# Altium schematic sheet GPIO.SchDoc
size A3
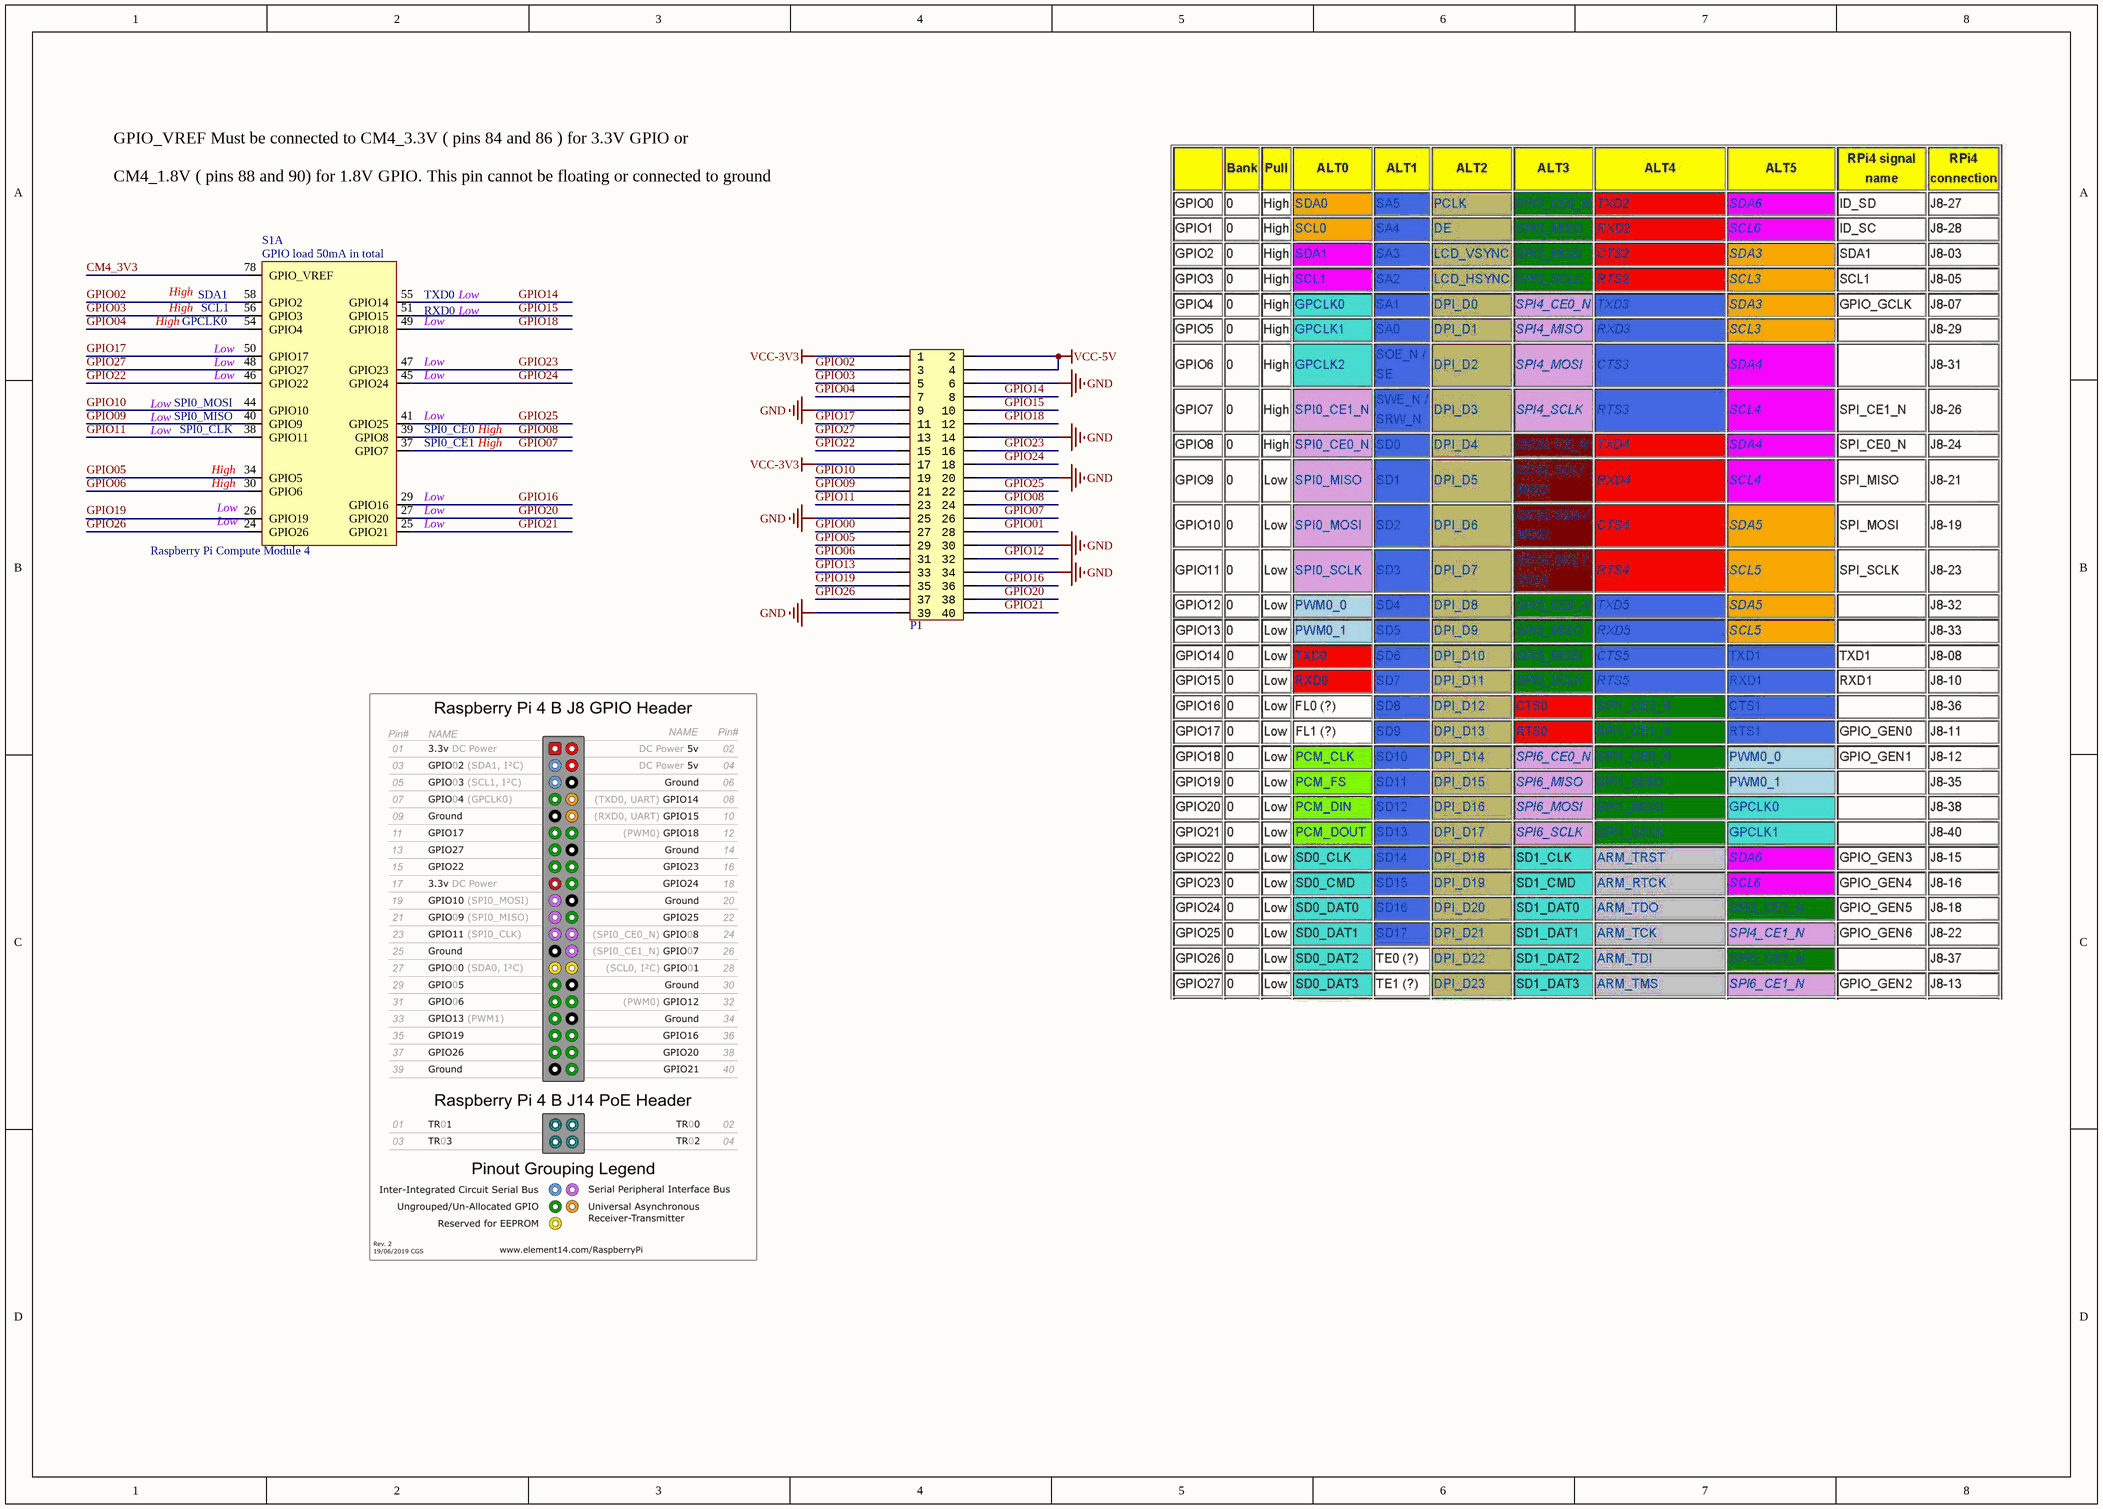
[diagram p0: GPIO.SchDoc]

## Parts
P1  HDR2x20_2.54  [HDR2X20_2.54_180]  (value not drawn)
S1  Raspberry Pi Compute Module 4  [CM4-DF40HC(3.0)-100DS-0.4v_3mm_1.5mm]  (part A of 21)

## Nets
GND: P1.6 P1.9 P1.14 P1.20 P1.25 P1.30 P1.34 P1.39
VCC-3V3: P1.1 P1.17
VCC-5V: P1.2 P1.4
CM4_3V3: S1.78(GPIO_VREF)
GPIO00: P1.27
GPIO01: P1.28
GPIO02: P1.3 S1.58(GPIO2)
GPIO03: P1.5 S1.56(GPIO3)
GPIO04: P1.7 S1.54(GPIO4)
GPIO05: P1.29 S1.34(GPIO5)
GPIO06: P1.31 S1.30(GPIO6)
GPIO07: P1.26 S1.37(GPIO7)
GPIO08: P1.24 S1.39(GPIO8)
GPIO09: P1.21 S1.40(GPIO9)
GPIO10: P1.19 S1.44(GPIO10)
GPIO11: P1.23 S1.38(GPIO11)
GPIO12: P1.32
GPIO13: P1.33
GPIO14: P1.8 S1.55(GPIO14)
GPIO15: P1.10 S1.51(GPIO15)
GPIO16: P1.36 S1.29(GPIO16)
GPIO17: P1.11 S1.50(GPIO17)
GPIO18: P1.12 S1.49(GPIO18)
GPIO19: P1.35 S1.26(GPIO19)
GPIO20: P1.38 S1.27(GPIO20)
GPIO21: P1.40 S1.25(GPIO21)
GPIO22: P1.15 S1.46(GPIO22)
GPIO23: P1.16 S1.47(GPIO23)
GPIO24: P1.18 S1.45(GPIO24)
GPIO25: P1.22 S1.41(GPIO25)
GPIO26: P1.37 S1.24(GPIO26)
GPIO27: P1.13 S1.48(GPIO27)

## Notes on the sheet
- (near S1) GPIO_VREF Must be connected to CM4_3.3V ( pins 84 and 86 ) for 3.3V GPIO or
  CM4_1.8V ( pins 88 and 90) for 1.8V GPIO. This pin cannot be floating or connected to ground
- Title
- Size:
- Date:
- A4
- Number:
- Time:
- Revision:
- Sheet
- of
- Q-Wave Systems Co.,Ltd
- 65/2 Moo 1 Beung
- Sriracha Chonburi
- Thailand
- File:
- (in symbol CM4, part A) GPIO load 50mA in total; High; SDA1; TXD0; Low; SCL1; RXD0; GPCLK0; SPI0_MOSI; SPI0_MISO; SPI0_CLK; SPI0_CE0; SPI0_CE1

## Library data of the parts
P1 = HDR2x20_2.54: Header
S1 = CM4: Raspberry Pi Compute Module 4 by Amornthep Phunsin